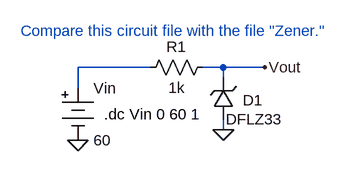
[diagram p0: schematic Zener2.asc]
Zener2.asc, the LTspice schematic file:
Version 4
SHEET 1 2024 848
WIRE -480 -464 -592 -464
WIRE -368 -464 -400 -464
WIRE -304 -464 -368 -464
WIRE -368 -448 -368 -464
WIRE -592 -432 -592 -464
WIRE -368 -368 -368 -384
FLAG -368 -368 0
FLAG -592 -352 0
FLAG -304 -464 Vout
SYMBOL Misc\\battery -592 -448 R0
WINDOW 123 0 0 Left 0
WINDOW 39 0 0 Left 0
SYMATTR InstName Vin
SYMATTR Value 60
SYMBOL zener -352 -384 R180
WINDOW 0 -45 29 Left 0
WINDOW 3 -76 0 Left 0
SYMATTR InstName D1
SYMATTR Value DFLZ33
SYMBOL res -384 -480 R90
WINDOW 0 0 56 VBottom 0
WINDOW 3 32 56 VTop 0
SYMATTR InstName R1
SYMATTR Value 1k
TEXT -552 -392 Left 0 !.dc Vin 0 60 1
TEXT -680 -520 Left 0 ;Compare this circuit file with the file "Zener."

The netlist it stands for:
* Zener2.asc
Vin N001 0 60
D1 0 Vout DFLZ33
R1 Vout N001 1k
.model D D
.lib standard.dio
.dc Vin 0 60 1
* Compare this circuit file with the file "Zener."
.backanno
.end